# Altium schematic sheet Main.SchDoc
size A4; SheetNumber: 1; SheetTotal: 11
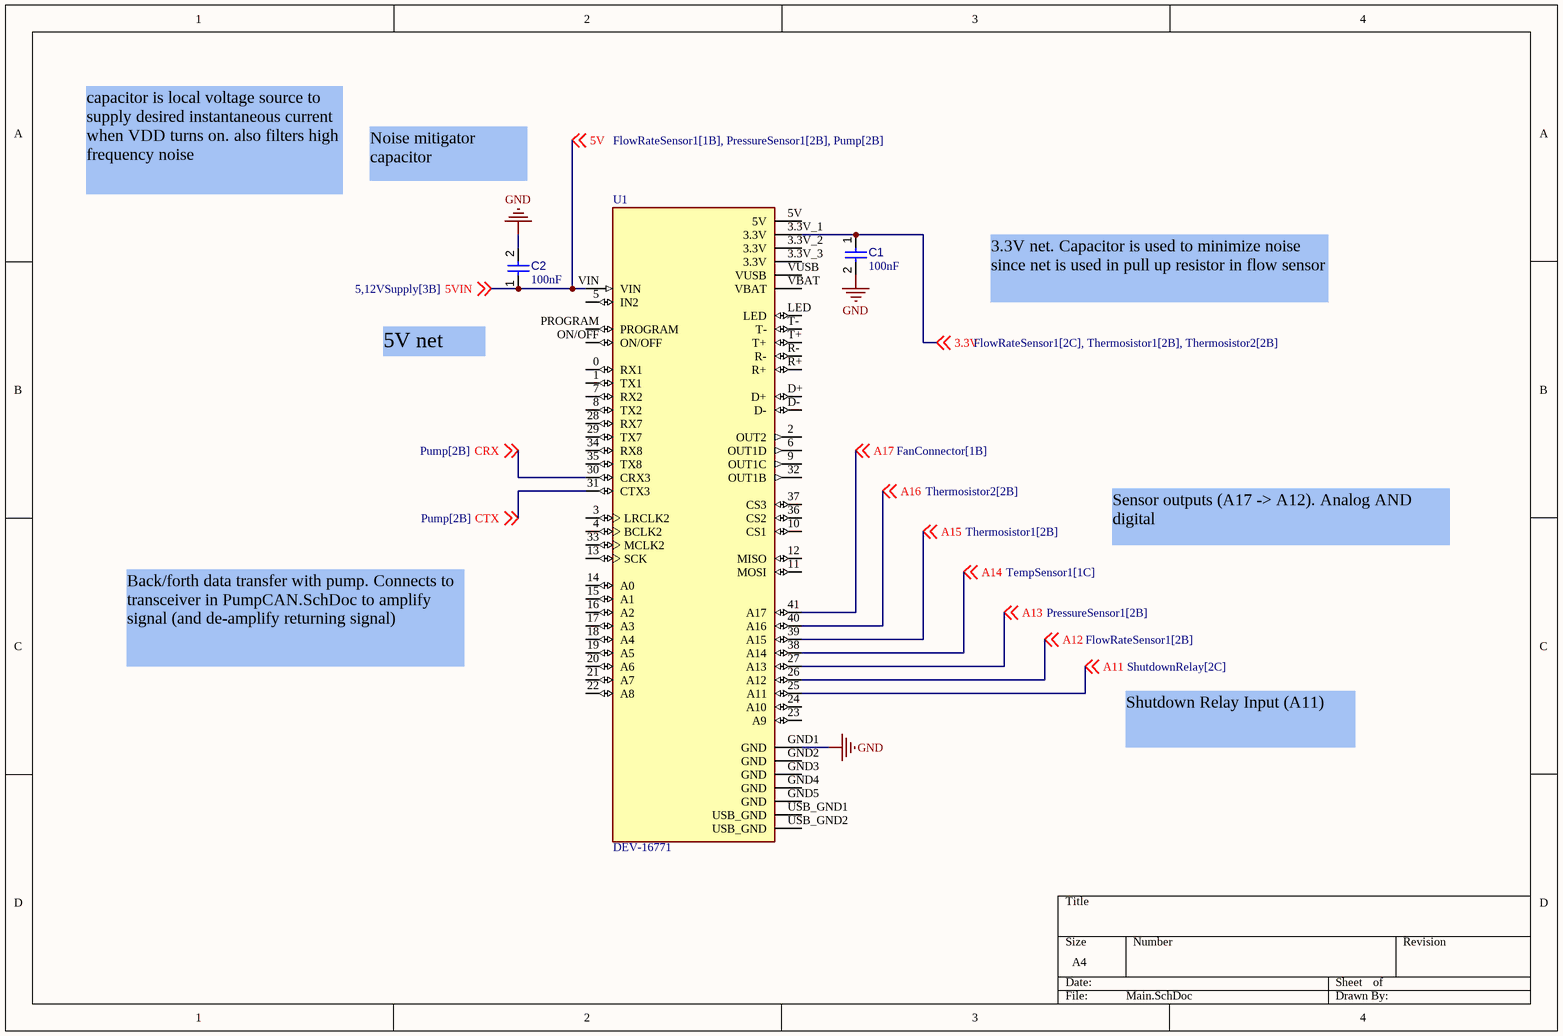
[diagram p0: Main.SchDoc]

## Parts
C1  value 100nF  [CAPC1005X56X25LL10T15]  (hidden comment: Capacitor 0.1 uF +/- 5% 16 V 0402)
C2  value 100nF  [CAPC1005X56X25LL10T15]  (hidden comment: Capacitor 0.1 uF +/- 5% 16 V 0402)
U1  DEV-16771  [MODULE_DEV-16771]

## Nets
GND: C1.2 C2.2 U1.GND1(GND)
3.3V: C1.1 U1.3.3V_1(3.3V) ; off-sheet 3.3V
5V: C2.1 U1.VIN ; off-sheet 5V, off-sheet 5VIN  [also labelled 5VIN]
A11: U1.25(A11) ; off-sheet A11
A12: U1.26(A12) ; off-sheet A12
A13: U1.27(A13) ; off-sheet A13
A14: U1.38(A14) ; off-sheet A14
A15: U1.39(A15) ; off-sheet A15
A16: U1.40(A16) ; off-sheet A16
A17: U1.41(A17) ; off-sheet A17
CRX: U1.30(CRX3) ; off-sheet CRX
CTX: U1.31(CTX3) ; off-sheet CTX

Not connected (* = marked no-connect by the designer): U1 0(RX1) 1(TX1) 2(OUT2) 3(LRCLK2) 3.3V_2(3.3V) 3.3V_3(3.3V) 4(BCLK2) 5(IN2) 5V 6(OUT1D) 7(RX2) 8(TX2) 9(OUT1C) 10(CS1) 11(MOSI) 12(MISO) 13(SCK) 14(A0) 15(A1) 16(A2) 17(A3) 18(A4) 19(A5) 20(A6) 21(A7) 22(A8) 23(A9) 24(A10) 28(RX7) 29(TX7) 32(OUT1B) 33(MCLK2) 34(RX8) 35(TX8) 36(CS2) 37(CS3) D+ D- GND2(GND) GND3(GND) GND4(GND) GND5(GND) LED ON/OFF PROGRAM R+ R- T+ T- USB_GND1(USB_GND) USB_GND2(USB_GND) VBAT VUSB

## Notes on the sheet
- Noise mitigator capacitor
- capacitor is local voltage source to supply desired instantaneous current when VDD turns on. also filters high frequency noise
- 3.3V net. Capacitor is used to minimize noise since net is used in pull up resistor in flow sensor
- 5V net
- Sensor outputs (A17 -> A12). Analog AND digital
- Back/forth data transfer with pump. Connects to transceiver in PumpCAN.SchDoc to amplify signal (and de-amplify returning signal)
- Shutdown Relay Input (A11)

## Library data of the parts
C1 C2 = CMP-001-00001-6: Chip Capacitor, 0.1 uF, +/- 5%, 16 V, 0402 (1005 Metric); Capacitor Type: Ceramic; Voltage Rating: 16V; Max Operating Temperature: 125°C; Min Operating Temperature: -55°C; Case/Package: 0402; Mounting Technology: SM; Pins: 2; Tolerance: 5%; RoHS Compliant: True
U1 = CMP-031-00006-1: RT1062 Teensy 4.1 series ARM® Cortex®-M7 MPU Embedded Evaluation Board; MF: SparkFun Electronics; Case/Package: None; Source: DEV-16771.SchLib; SnapEDA_Link: https://www.snapeda.com/parts/DEV-16771/SparkFun+Electronics/view-part/?ref=snap; Component Type: Standard; Value: *; Design Item ID: DEV-16771; Check_prices: https://www.snapeda.com/parts/DEV-16771/SparkFun+Electronics/view-part/?ref=eda; MP: DEV-16771; Pins: 65